# Altium schematic sheet power.SchDoc
size A4
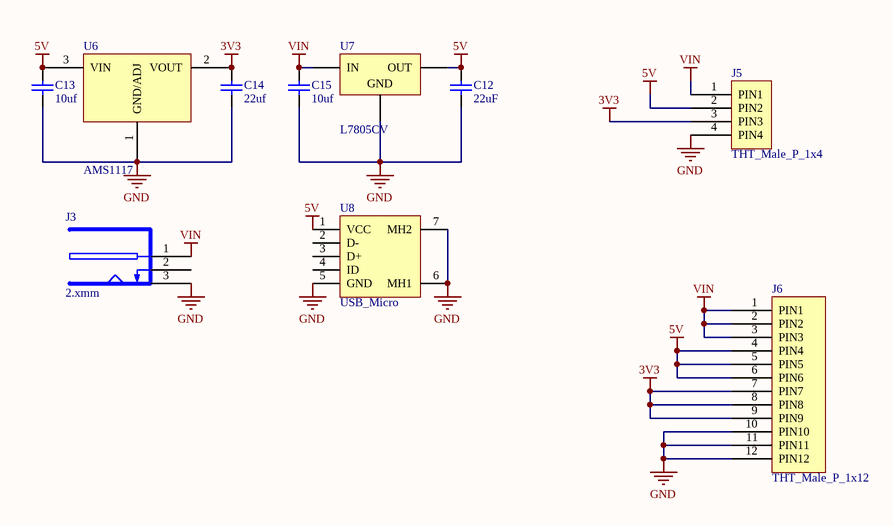
[diagram p0: power.SchDoc]

## Parts
C12  22uF  [1210]
C13  value 10uf  [1210]  (hidden comment: Capacitor)
C14  value 22uf  [1210]  (hidden comment: Capacitor)
C15  10uf  [1210]
J3  2.xmm  [FP_DC_TAP_ANYA]
J5  THT_Male_P_1x4  [THT_Male_P_1x4-2.54mm]
J6  THT_Male_P_1x12  [THT_Male_P_1x12-2.54mm]
U6  AMS1117  [AMS1117-ADJ]
U7  L7805CV  [SOT-223]
U8  USB_Micro  [USB_Micro_Standard]

## Nets
3V3: C14.2 J5.3(PIN3) J6.7(PIN7) J6.8(PIN8) J6.9(PIN9) U6.2(VOUT)
5V: C12.2 C13.2 J5.2(PIN2) J6.4(PIN4) J6.5(PIN5) J6.6(PIN6) U6.3(VIN) U7.OUT U8.1(VCC)
GND: C12.1 C13.1 C14.1 C15.1 J3.3(GND) J5.4(PIN4) J6.10(PIN10) J6.11(PIN11) J6.12(PIN12) U6.1(GND/ADJ) U7.GND U8.5(GND) U8.6(MH1) U8.7(MH2)
VIN: C15.2 J3.1(9V) J5.1(PIN1) J6.1(PIN1) J6.2(PIN2) J6.3(PIN3) U7.IN

Not connected (* = marked no-connect by the designer): J3 2(GND); U8 2(D-) 3(D+) 4(ID)

## Library data of the parts
C12 C15 = CAP: Capacitor
  C12: Value: 22uF
  C15: Value: 10uf
C13 C14 = Capacitor: Ceramic Chip Capacitor - Standard; Note: Footprint corresponds to dimensions for bulk cassette packaging. This case size has tightened tolerances.; Published: 17-Jul-2002; LatestRevisionDate: 19-Mar-2004; LatestRevisionNote: Silkscreen size reduced.; DatasheetDocument: Mar-2001; PackageDocument: Mar-2001; PackageReference: 0805; Publisher: Altium Limited; Code_JEITA: 0805; Code_IPC: 2012[0805]; ComponentLink1Description: Manufacturer Link; ComponentLink1URL: http://www.kemet.com/; ComponentLink2Description: Datasheet; ComponentLink2URL: http://www.kemet.com/kemet/web/homepage/kechome.nsf/vapubfilesname/F3102TA.pdf/$file/F3102TA.pdf
J3 = DC_TAP_ANYA: 2.xmm DC HEBA25 TÁPFESZÜLTSÉG ALJZAT ZÁRT, NYÁKBA 90°; Supplier: Lomex 43-07-67
J5 = THT_Male_P_1x4: THT Male pin header strip 1x4
J6 = THT_Male_P_1x12: THT Male pin header strip 1x12
U6 = AMS1117: AMS1117 1A LOW DROPOUT VOLTAGE REGULATOR
U7 = L7805CV: Positive Voltage Regulator; pin to pad: GND>1 IN>3 OUT>2; Note: Tab is connected to pin 3 (GND).; Published: 24-Aug-2001; LatestRevisionDate: 17-Jul-2002; LatestRevisionNote: Re-released for DXP Platform.; DatasheetVersion: Dec-1998; PackageVersion: Jun-1998; PackageReference: TO220ABN; Publisher: Altium Limited; PackageDescription: TO, Thru-Hole, Vertical, Heatsink Mounted; 3 In-Line Leads; Pitch 2.54 mm; Pin sequence 1, 3, 2; ComponentLink1Description: Manufacturer Link; ComponentLink1URL: http://www.st.com/
U8 = USB_Micro: USB micro female